# EAGLE design switch plate (EAGLE 9.6.2)
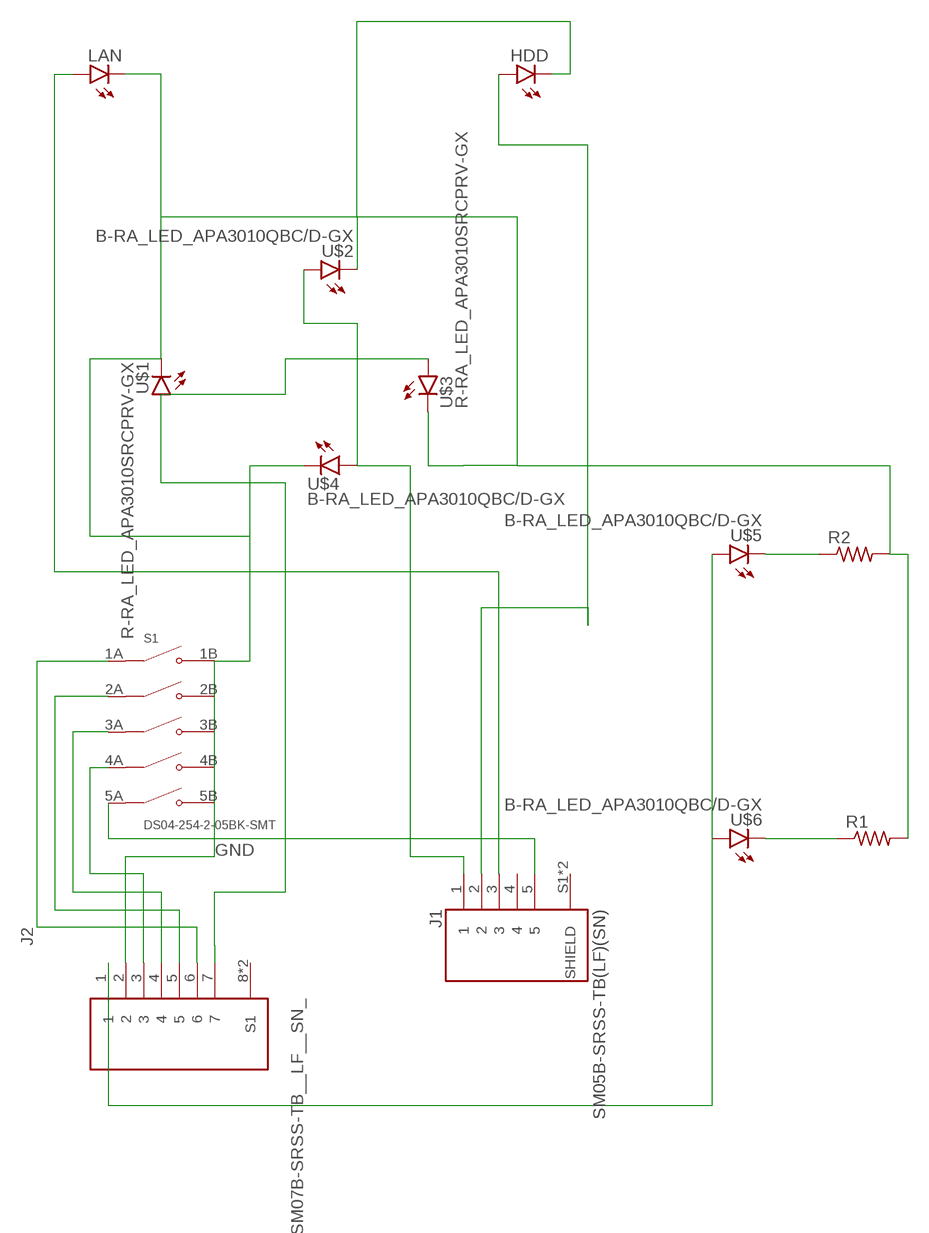
[diagram p0: schematic, sheet 1]

## Parts
HDD  LEDCHIP-LED0603  [CHIP-LED0603]
J1  SM05B-SRSS-TB(LF)(SN)  [JST_SM05B-SRSS-TB(LF)(SN)]
J2  SM07B-SRSS-TB__LF__SN_  [SM07B-SRSS-TB]
LAN  LEDCHIP-LED0603  [CHIP-LED0603]
R1  R-US_R0603  [R0603]
R2  R-US_R0603  [R0603]
S1  DS04-254-2-05BK-SMT  [SW_DS04-254-2-05BK-SMT]
U$1  R-RA_LED_APA3010SRCPRV-GX  [APBA3010ESGC]
U$2  B-RA_LED_APA3010QBC/D-GX  [APBA3010ESGC]
U$3  R-RA_LED_APA3010SRCPRV-GX  [APBA3010ESGC]
U$4  B-RA_LED_APA3010QBC/D-GX  [APBA3010ESGC]
U$5  B-RA_LED_APA3010QBC/D-GX  [APBA3010ESGC]
U$6  B-RA_LED_APA3010QBC/D-GX  [APBA3010ESGC]

## Nets
GND: HDD.C J2.2 LAN.C R1.2 R2.2 S1.1B(NO1) S1.2B(NO2) S1.3B(NO3) S1.4B(NO4) S1.5B(NO5) U$1.3(C) U$2.3(C) U$3.3(C) U$4.3(C)
N$1: J2.1 U$5.1(A) U$6.1(A)
N$2: J2.3 S1.4A(COM4)
N$3: J2.4 S1.3A(COM3)
N$4: J2.5 S1.2A(COM2)
N$5: J2.6 S1.1A(COM1)
N$6: J2.7 U$1.1(A) U$3.1(A)
N$7: J1.1 U$2.1(A) U$4.1(A)
N$8: HDD.A J1.2
N$9: J1.3 LAN.A
N$10: J1.5 S1.5A(COM5)
N$11: R2.1 U$5.3(C)
N$12: R1.1 U$6.3(C)
Unconnected: J1.4 J1.S1(SHIELD) J1.S2(SHIELD) J2.8(S1) J2.9(S1)

## Library data of the parts
HDD LAN = xecuter parts:LED: LED OSRAM: - CHIPLED LG R971, LG N971, LY N971, LG Q971, LY Q971, LO R971, LY R971 LH N974, LH R974 LS Q976, LO Q976, LY Q976 LO Q996 - Hyper CHIPLED LW Q18S LB Q993, LB Q99A, LB R99A - SideLED LS A670, LO A670, LY A670, LG A670, LP A670 LB A673, LV A673, LT A673, LW A673 LH A674 LY A675 LS A676, LA A676, LO A676, LY A676, LW A676 LS A679, LY A679, LG A679 - Hyper Micro SIDELED® LS Y876, LA Y876, LO Y876, LY Y876 LT Y87S - SmartLED LW L88C, LW L88S LB L89C, LB L89S, LG L890 LS L89K, LO L89K, LY L89K LS L896, LA L896, LO L896, LY L896 - TOPLED LS T670, LO T670, LY T670, LG T670, LP T670 LSG T670, LSP T670, LSY T670, LOP T670, LYG T670 LG T671, LOG T671, LSG T671 LB T673, LV T673, LT T673, LW T673 LH T674 LS T676, LA T676, LO T676, LY T676, LB T676, LH T676, LSB T676, LW T676 LB T67C, LV T67C, LT T67C, LS T67K, LO T67K, LY T67K, LW E67C LS E67B, LA E67B, LO E67B, LY E67B, LB E67C, LV E67C, LT E67C LW T67C LS T679, LY T679, LG T679 LS T770, LO T770, LY T770, LG T770, LP T770 LB T773, LV T773, LT T773, LW T773 LH T774 LS E675, LA E675, LY E675, LS T675 LS T776, LA T776, LO T776, LY T776, LB T776 LHGB T686 LT T68C, LB T68C - Hyper Mini TOPLED® LB M676 - Mini TOPLED Santana® LG M470 LS M47K, LO M47K, LY M47K Source: http://www.osram.convergy.de LUXEON: - LUMILED® LXK2-PW12-R00, LXK2-PW12-S00, LXK2-PW14-U00, LXK2-PW14-V00 LXK2-PM12-R00, LXK2-PM12-S00, LXK2-PM14-U00 LXK2-PE12-Q00, LXK2-PE12-R00, LXK2-PE12-S00, LXK2-PE14-T00, LXK2-PE14-U00 LXK2-PB12-K00, LXK2-PB12-L00, LXK2-PB12-M00, LXK2-PB14-N00, LXK2-PB14-P00, LXK2-PB14-Q00 LXK2-PR12-L00, LXK2-PR12-M00, LXK2-PR14-Q00, LXK2-PR14-R00 LXK2-PD12-Q00, LXK2-PD12-R00, LXK2-PD12-S00 LXK2-PH12-R00, LXK2-PH12-S00 LXK2-PL12-P00, LXK2-PL12-Q00, LXK2-PL12-R00 Source: www.luxeon.com KINGBRIGHT: KA-3528ASYC Source: www.kingbright.com
J1 = xecuter parts:SM05B-SRSS-TB(LF)(SN): SH Series 5 Position 1 mm Pitch Surface Mount Side Entry Shrouded Header Check prices <https://pricing.snapeda.com/parts/SM05B-SRSS-TB%28LF%29%28SN%29/JST%20Sales/view-part?ref=eda>; AVAILABILITY: Warning; DESCRIPTION: Connector Header Surface Mount, Right Angle 5 position 0.039 (1.00mm); MF: JST Sales; MP: SM05B-SRSS-TB(LF)(SN); PACKAGE: None; PRICE: None; PURCHASE-URL: https://pricing.snapeda.com/search/part/SM05B-SRSS-TB(LF)(SN)/?ref=eda
J2 = xecuter parts:SM07B-SRSS-TB__LF__SN_: JST SH Series, 1mm Pitch 7 Way 1 Row Right Angle PCB Header, Solder Termination, 1A Source: Datasheet <http://uk.rs-online.com/web/p/products/5468833>; ARROW_PART_NUMBER: SM07B-SRSS-TB (LF)(SN); ARROW_PRICE-STOCK: https://www.arrow.com/en/products/sm07b-srss-tb-lf-sn/jst-manufacturing; DESCRIPTION: JST SH Series, 1mm Pitch 7 Way 1 Row Right Angle PCB Header, Solder Termination, 1A; HEIGHT: mm; MANUFACTURER_NAME: JST (JAPAN SOLDERLESS TERMINALS); MANUFACTURER_PART_NUMBER: SM07B-SRSS-TB (LF)(SN)
R1 R2 = xecuter parts:R-US_: RESISTOR, American symbol; SPICEPREFIX: R
S1 = xecuter parts:DS04-254-2-05BK-SMT; CUI_PURCHASE_URL: https://www.cuidevices.com/product/switches/dip-switches/ds04-254-smt-series?utm_source=snapeda.com&utm_medium=referral&utm_campaign=snapedaBOM; DESCRIPTION: 5 Position, Surface Mount, 2.54 mm Pitch, Flat Slide Actuator, Flat Bottom, SMT Pin, DIP Switch; DIGI-KEY_PART_NUMBER: 2223-DS04-254-2-05BK-SMT-TR-ND; MF: CUI Devices; MP: DS04-254-2-05BK-SMT; PACKAGE: None; PURCHASE-URL: https://pricing.snapeda.com/search/part/DS04-254-2-05BK-SMT/?ref=eda
U$1 U$3 = xecuter parts:R-RA_LED_APA3010SRCPRV-GX; COLOR: red; MANU: kingbright; PART#: apa3010srcprv-gx
U$2 U$4-U$6 = xecuter parts:B-RA_LED_APA3010QBC/D-GX; COLOR: blue; MANU: kingbright; PART#: APA3010QBC/D-GX

## Board
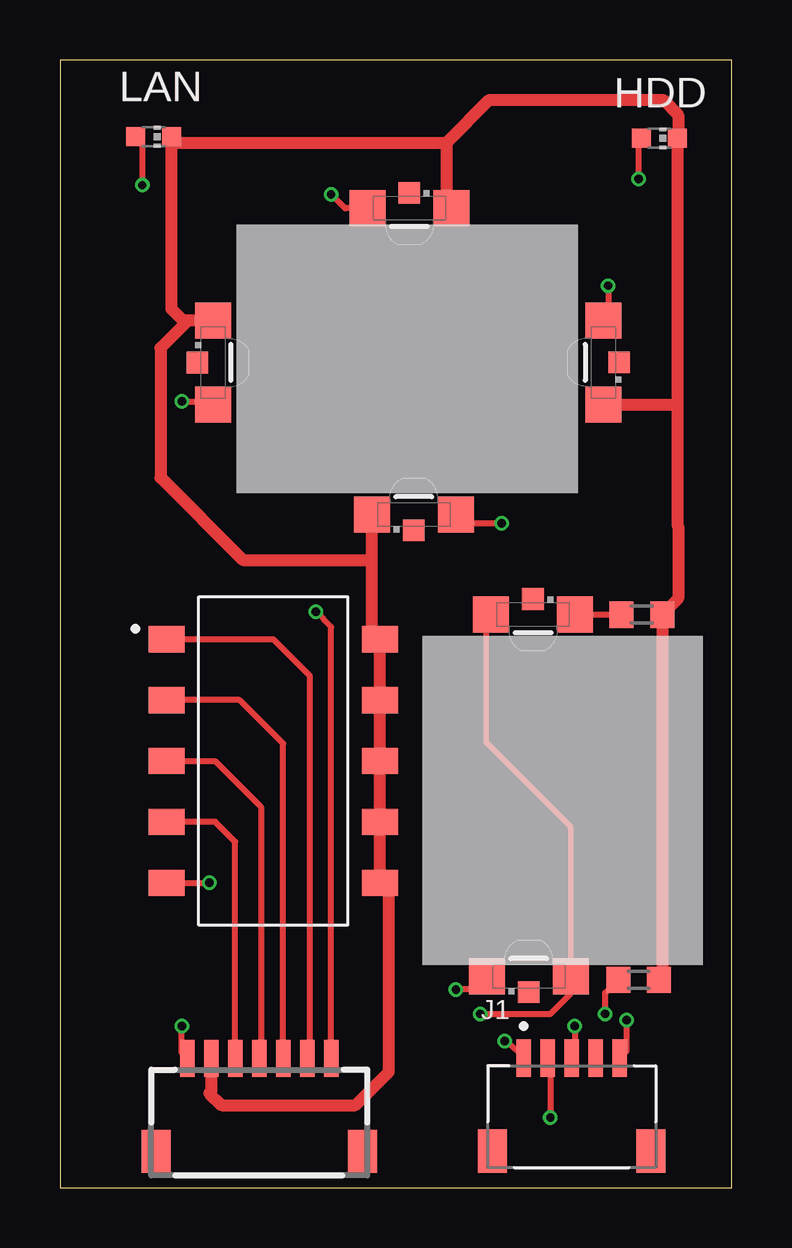
[diagram p1: board, top side]
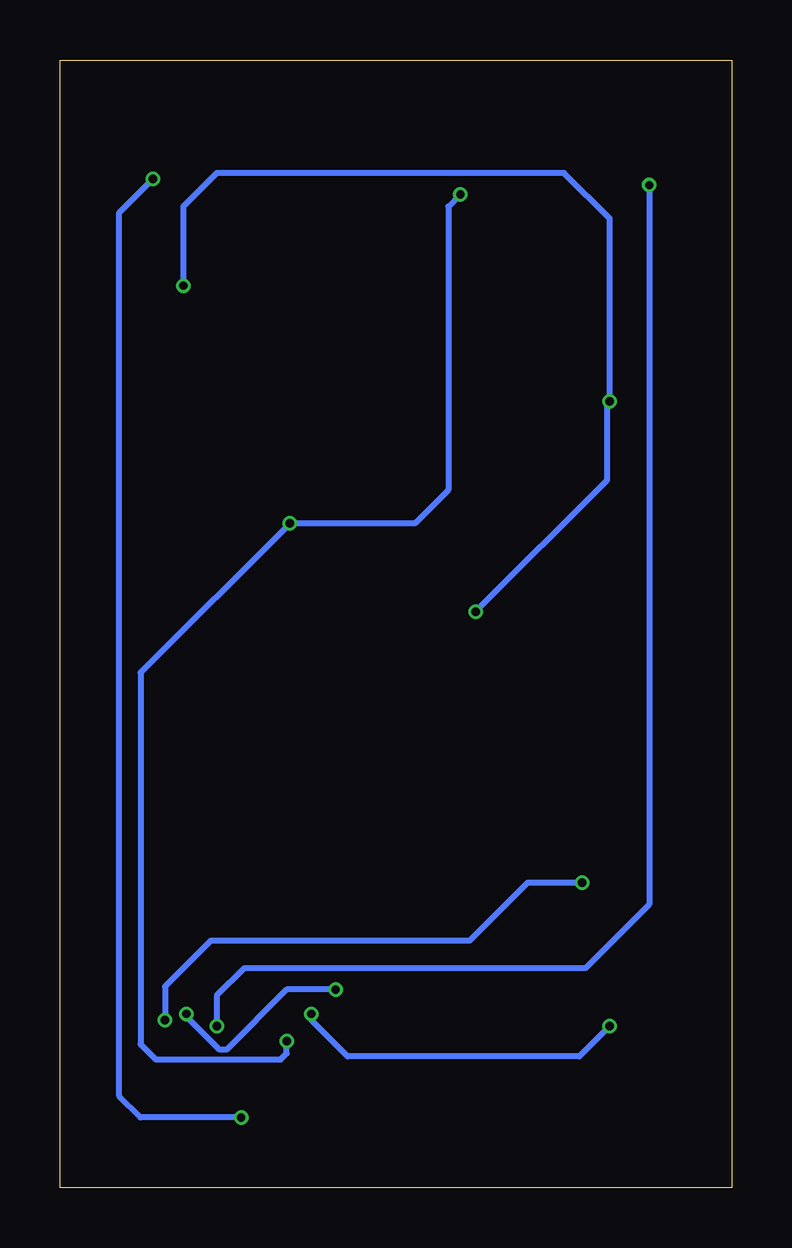
[diagram p2: board, bottom side, seen from below]

Size 28 x 47 mm. Coordinates in mm from the lower left corner, seen from the top.
Outline: 0,0 28,0 28,47 0,47 0,0
Copper layers (1*16): Top 0.035559375mm / dielectric 1.6mm / Bottom 0.035559375mm
Design rules "oshpark-2layer *": minimum track width 6mil, minimum drill 10mil, track to track 6mil, track to pad 6mil, pad to pad 6mil, via to via 6mil, smd to smd 6mil, copper to edge 15mil, drill to drill 6mil, minimum pad ring 5mil, minimum via ring 5mil, stop-mask expansion 2.5mil, vias tented up to drill 20mil, thermal gap 10mil
tKeepout: area 2.4,43.1 to 5.3,44.6; area 23.4,42.9 to 26.5,44.5; area 1.4,-7.7 to 11.7,-2.1; area 15.3,-7.2 to 23.8,-1.8; 12 lines

### Footprints (pad centres in the part's own frame; a part is rotated, then mirrored left to right if it is on the bottom)
CHIP-LED0603 = smd 0.8 x 0.8: A 0,-0.75; C 0,0.75
JST_SM05B-SRSS-TB(LF)(SN) = smd 0.6 x 1.55: 1 -2,3.875; 2 -1,3.875; 3 0,3.875; 4 1,3.875; 5 2,3.875 | smd 1.2 x 1.8: S1 -3.3,0; S2 3.3,0
SM07B-SRSS-TB = smd 0.6 x 1.55: 1 1.5,4.877; 2 2.5,4.877; 3 3.5,4.877; 4 4.5,4.877; 5 5.5,4.877; 6 6.5,4.877; 7 7.5,4.877 | smd 1.2 x 1.8: 8 0.2,1.002; 9 8.8,1.002
R0603 = smd 1 x 1.1: 1 -0.85,0; 2 0.85,0
SW_DS04-254-2-05BK-SMT = smd 1.5 x 1.1: 1A -4.45,5.08; 1B 4.45,5.08; 2A -4.45,2.54; 2B 4.45,2.54; 3A -4.45,0; 3B 4.45,0; 4A -4.45,-2.54; 4B 4.45,-2.54; 5A -4.45,-5.08; 5B 4.45,-5.08
APBA3010ESGC = smd 1.5 x 1.5: 1 -1.75,0; 3 1.75,0 | smd 0.9 x 0.9: 2 0,0.65

### Placement (x,y rotation side)
HDD  24.99,43.73 270 top
J1  21.34,1.52 0 top
J2  3.81,0.51 0 top
LAN  3.91,43.8 270 top
R1  24.26,23.88 0 top
R2  24.12,8.66 0 top
S1  8.89,17.78 0 top
U$1  6.38,34.39 90 top
U$2  14.57,40.82 0 top
U$3  22.65,34.39 270 top
U$4  14.75,28.05 180 top
U$5  19.54,8.8 180 top
U$6  19.72,23.88 0 top

### Tracks (layer width: path | path; a pad name or v marks a point on that pad's centre or on a via)
GND
  Top 0.508: J2.2 6.31,4.02 6.22,3.94 6.73,3.43 12.32,3.43 13.72,4.83 13.72,12.32 S1.5B S1.4B S1.3B S1.2B S1.1B 13,23.2 13,26.16 | 13,26.16 U$4.3 | U$1.3 5.33,36.14 | 5.33,36.14 5.14,36.14 4.66,36.62 LAN.C 4.9,43.56 16.13,43.56 | 5.33,36.14 4.19,34.99 4.19,29.59 7.62,26.16 13,26.16 | 16.13,43.56 17.91,45.34 25.15,45.34 25.78,44.7 25.78,43.77 HDD.C 25.74,32.77 | 25.74,32.77 25.74,27.6 25.78,27.56 25.78,24.56 R1.2 25.11,8.79 R2.2 | U$3.3 25.62,32.64 25.74,32.77 | U$2.3 16.13,41 16.13,43.56
N$1  (via drill 0.35)
  Top 0.254: J2.1 5.08,5.62 v5.08,6.73 | U$6.1 17.78,23.69 17.78,18.54 21.29,15.03 U$5.1 21.29,8.09 20.45,7.24 v17.53,7.24
  Bottom 0.254: v5.08,6.73 6.35,5.46 16,5.46 17.53,6.99 v17.53,7.24
N$2
  Top 0.254: J2.3 7.31,14.41 6.48,15.24 S1.4A
N$3
  Top 0.254: S1.3A 6.48,17.78 8.38,15.88 8.38,5.46 J2.4
N$4
  Top 0.254: J2.5 9.31,18.5 7.49,20.32 S1.2A
N$5
  Top 0.254: S1.1A 8.89,22.86 10.41,21.34 10.41,5.49 J2.6
N$6  (via drill 0.35)
  Top 0.254: J2.7 11.31,23.36 v10.67,24 | v5.08,32.77 6.25,32.77 U$1.1 | v22.86,37.59 22.86,36.35 U$3.1
  Bottom 0.254: v10.67,24 5.21,29.46 5.21,32.64 v5.08,32.77 5.08,40.39 6.99,42.29 21.46,42.29 22.86,40.89 v22.86,37.59
N$7  (via drill 0.35)
  Top 0.254: U$2.1 11.89,40.82 v11.3,41.4 | v18.41,27.69 16.87,27.69 U$4.1 | v18.54,6.1 18.64,6.1 J1.1
  Bottom 0.254: v11.3,41.4 11.81,40.89 11.81,29.08 13.21,27.69 v18.41,27.69 24.64,21.46 24.64,5.97 24,5.33 18.8,5.33 18.54,5.59 v18.54,6.1
N$8  (via drill 0.35)
  Top 0.254: J1.2 20.45,5.29 v20.45,2.92 | v24.13,42.04 24.13,43.62 HDD.A
  Bottom 0.254: v20.45,2.92 24.64,2.92 25.53,3.81 25.53,40.64 v24.13,42.04
N$9  (via drill 0.35)
  Top 0.254: LAN.A 3.43,43.53 v3.43,41.78 | v21.46,6.73 21.46,5.53 J1.3
  Bottom 0.254: v3.43,41.78 3.43,11.81 6.1,9.14 20.32,9.14 21.46,8 v21.46,6.73
N$10  (via drill 0.35)
  Top 0.254: S1.5A v6.22,12.7 | v23.62,6.99 23.62,5.68 J1.5
  Bottom 0.254: v6.22,12.7 8.51,12.7 10.92,10.29 21.72,10.29 23.62,8.38 v23.62,6.99
N$11  (via drill 0.35)
  Top 0.254: U$5.3 17.25,8.26 v16.51,8.26 | v22.73,7.24 22.73,8.12 R2.1
  Bottom 0.254: v16.51,8.26 18.54,8.26 21.06,5.74 21.34,5.74 22.73,7.14 v22.73,7.24
N$12
  Top 0.254: U$6.3 R1.1